# Altium project 100871_project.prjpcb
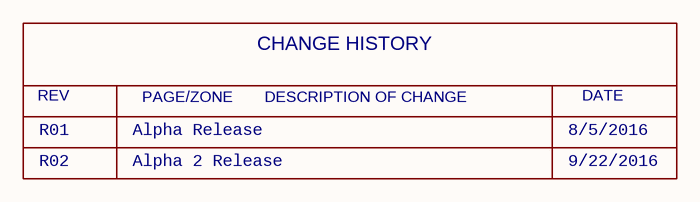
[diagram p0: BlockDiagram.SchDoc]
Board_Name: Trackpad Controller Board; Board_Number: 100871; PCB_Revision: 02; Project_Name: Ventriloquist; Sch_Revision: 02
3 sheets, 95 parts. Net scope: global (net labels, ports and power ports of the same name join across sheets).
Board file: 100871.PcbDoc
Sheets:
  BlockDiagram.SchDoc
  ControlBoard.SchDoc
  RevisionLog.SchDoc

## Sheet BlockDiagram.SchDoc: Block Diagram
size 431 x 279 mm; DrawnBy: D. Bruey; Organization: Synapse Product Development, LLC.; Address1: 1511 6th Ave., Suite 400; Address2: Seattle, Washington 98101; Address3: 206.381.0898; Address4: www.synapse.com; DocumentNumber: 1; SheetNumber: 1; SheetTotal: 3; PageSetup: Record=PageOptions|CenterHorizontal=True|CenterVertical=True|PrintScale=1.06|XCorrection=1.00|YCorrection=1.00|PrintKind=1|BorderSize=5000000|LeftOffset=0|BottomOffset=0|Orientation=2|PaperLength=4318|PaperWidth=2794|Scale=100|PaperSource=7|PrintQuality=200|MediaType=1|DitherType=10|PrintScaleMode=1|PaperKind=11x17|PaperIndex=3

### Notes on the sheet
- REV
- PAGE/ZONE       DESCRIPTION OF CHANGE
- CHANGE HISTORY
- DATE
- R01
- R02
- Alpha Release
- Alpha 2 Release
- 8/5/2016
- 9/22/2016
- Design Notes:
- Layout Notes:
- Project:
- Sheet Title:
- PCBA:
- PROPRIETARY AND CONFIDENTIAL
- Drawn by:
- Schematic Part Number:
- Schematic Revision:
- Date:
- Sheet:
- /

## Sheet ControlBoard.SchDoc: Controls
size 431 x 279 mm; DrawnBy: D. Bruey; Organization: Synapse Product Development, LLC.; Address1: 1511 6th Ave., Suite 400; Address2: Seattle, Washington 98101; Address3: 206.381.0898; Address4: www.synapse.com; DocumentNumber: 2; SheetNumber: 2; SheetTotal: 3; PageSetup: Record=PageOptions|CenterHorizontal=True|CenterVertical=True|PrintScale=1.06|XCorrection=1.00|YCorrection=1.00|PrintKind=1|BorderSize=5000000|LeftOffset=0|BottomOffset=0|Orientation=2|PaperLength=4318|PaperWidth=2794|Scale=100|PaperSource=7|PrintQuality=200|MediaType=1|DitherType=10|PrintScaleMode=1|PaperKind=11x17|PaperIndex=3
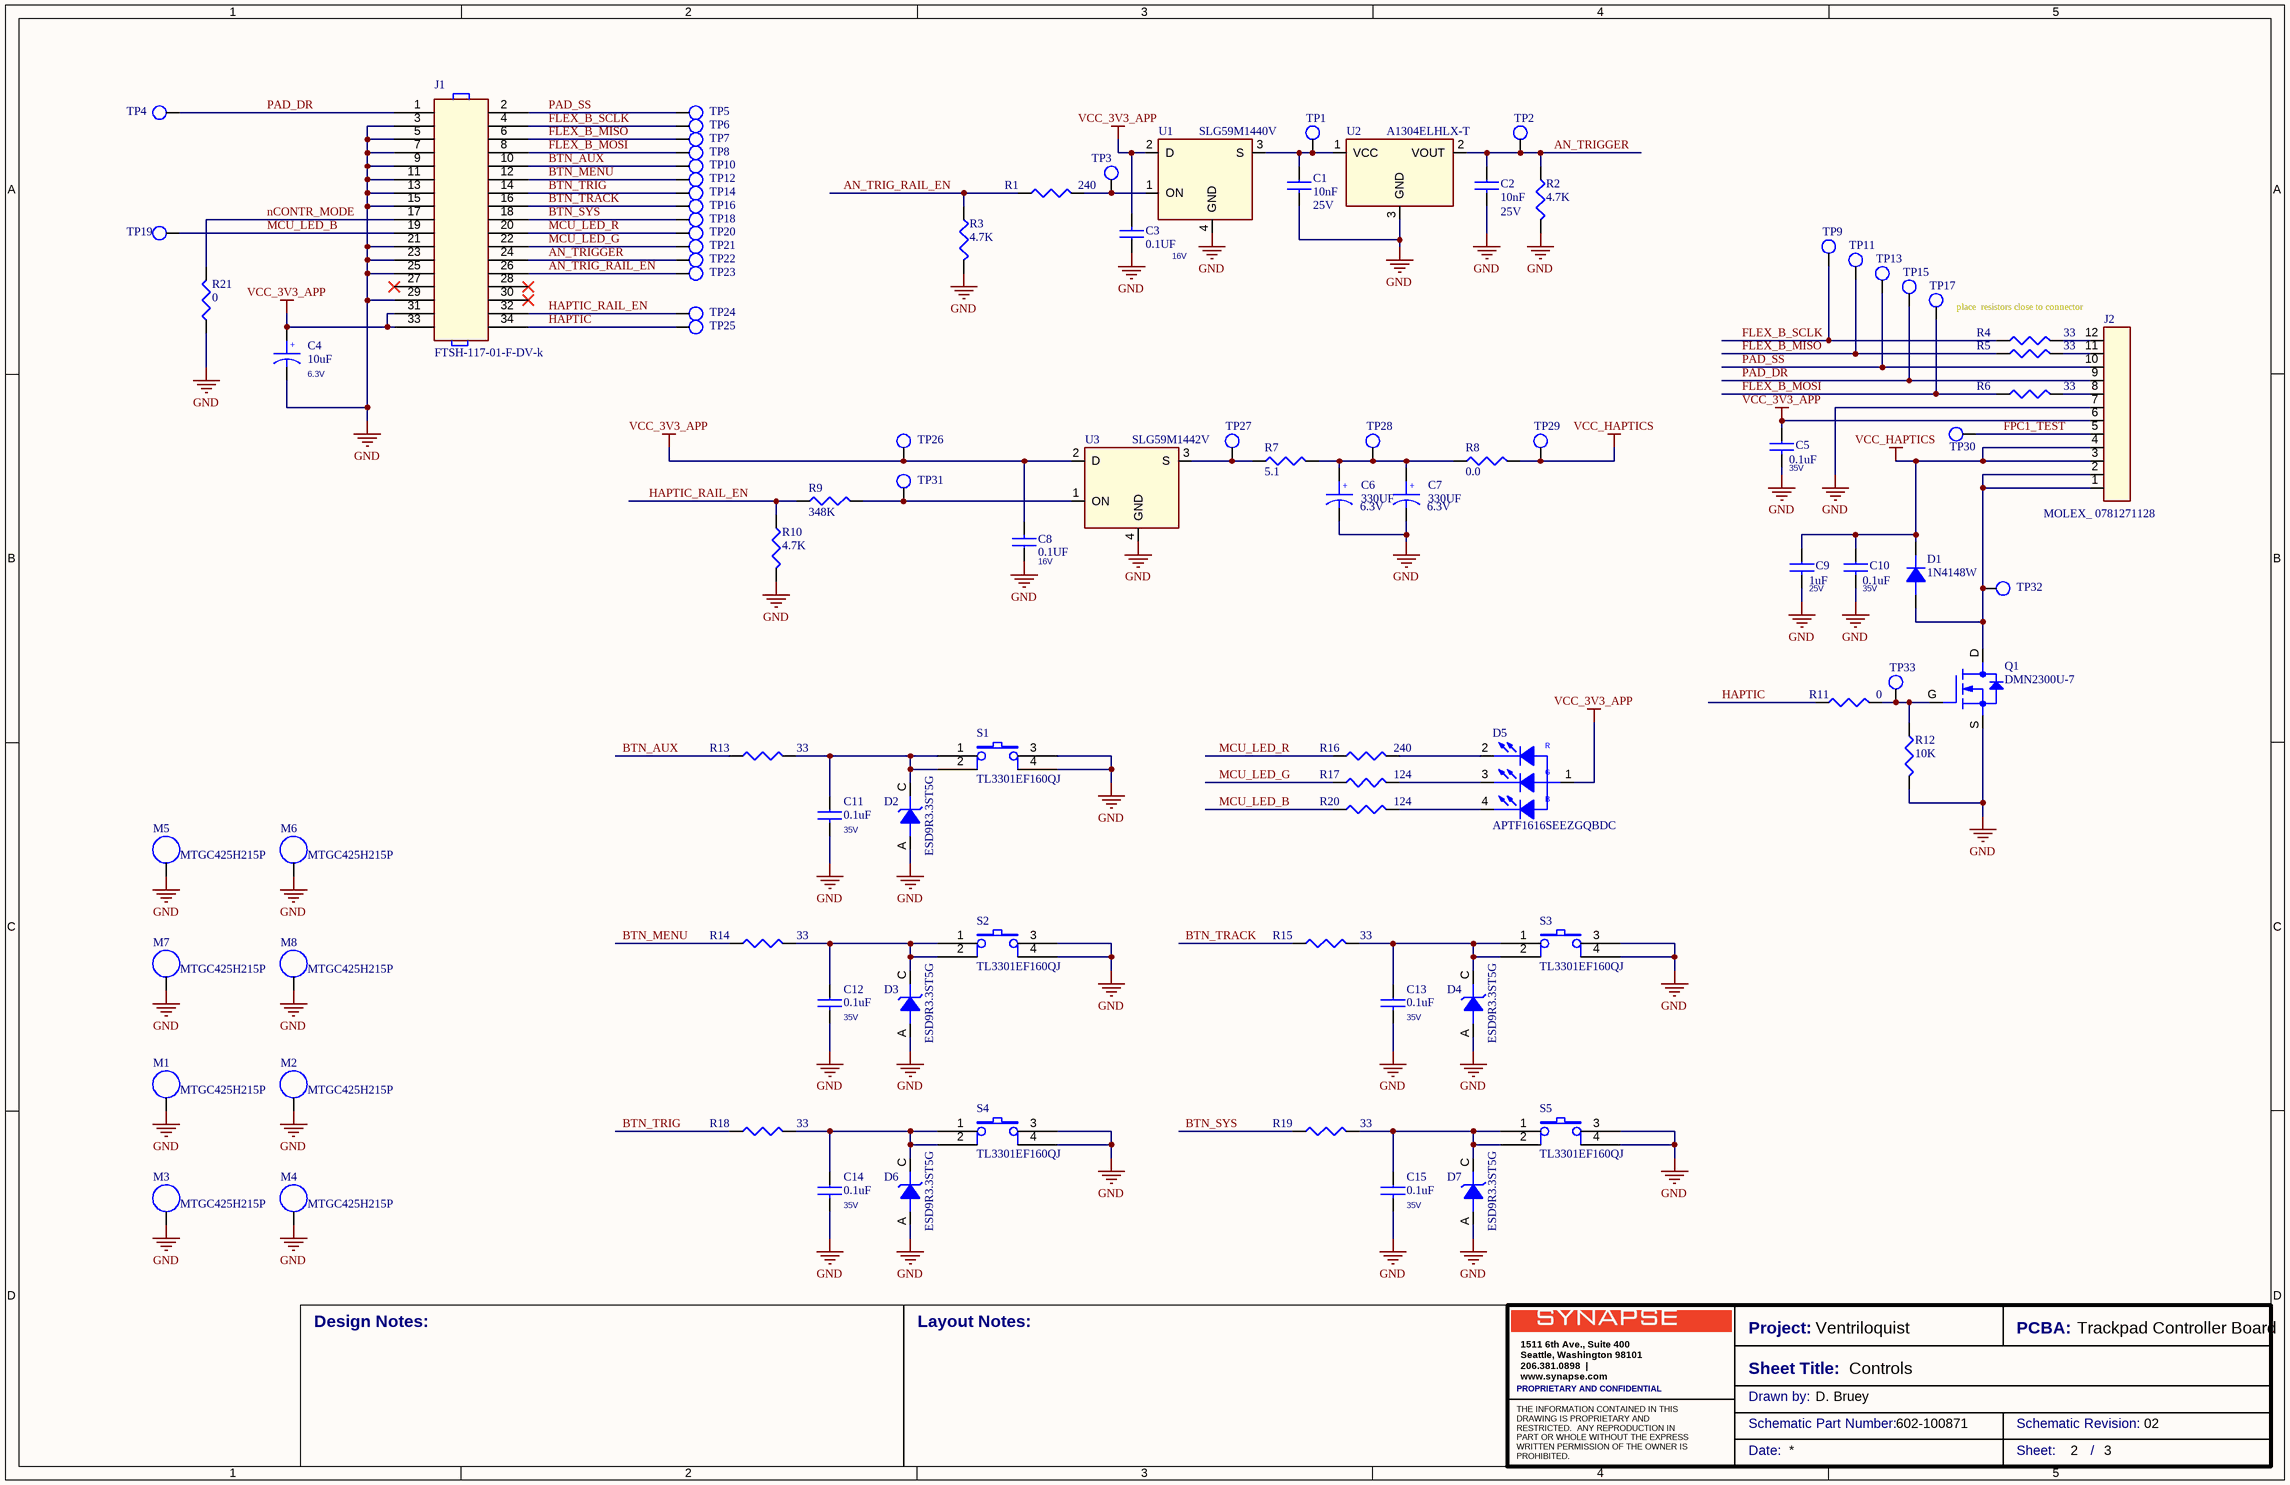
[diagram p1: ControlBoard.SchDoc]

### Parts
C1  10nF  Voltage: 25V  [0402-ipcsm_60]
C2  10nF  Voltage: 25V  [0402-ipcsm_60]
C3  0.1UF  Voltage: 16V  [0603-ipcsm_90]
C4  10uF  Voltage: 6.3V  [c-0603-POL_35H]
C5  0.1uF  Voltage: 35V  [0402-IPCsm_55]
C6  330UF  Voltage: 6.3V  [c-elect_FK-D8]
C7  330UF  Voltage: 6.3V  [c-elect_FK-D8]
C8  0.1UF  Voltage: 16V  [0603-ipcsm_90]
C9  1uF  Voltage: 25V  [0603-IPCsm_90]
C10  0.1uF  Voltage: 35V  [0402-IPCsm_55]
C11  0.1uF  Voltage: 35V  [0402-IPCsm_55]
C12  0.1uF  Voltage: 35V  [0402-IPCsm_55]
C13  0.1uF  Voltage: 35V  [0402-IPCsm_55]
C14  0.1uF  Voltage: 35V  [0402-IPCsm_55]
C15  0.1uF  Voltage: 35V  [0402-IPCsm_55]
D1  1N4148W  [SOD123_135]
D2  ESD9R3.3ST5G  [sod923-40]
D3  ESD9R3.3ST5G  [sod923-40]
D4  ESD9R3.3ST5G  [sod923-40]
D5  APTF1616SEEZGQBDC  [led_RBG_1p6x1p6_sm]
D6  ESD9R3.3ST5G  [sod923-40]
D7  ESD9R3.3ST5G  [sod923-40]
J1  FTSH-117-01-F-DV-k  [FTSH-117-01-XXX-DV-K]
J2  MOLEX_ 0781271128  [con12_molex_0781271128]
M1  MTGC425H215P  [MTGC425H215P]  (no BOM)
M2  MTGC425H215P  [MTGC425H215P]  (no BOM)
M3  MTGC425H215P  [MTGC425H215P]  (no BOM)
M4  MTGC425H215P  [MTGC425H215P]  (no BOM)
M5  MTGC425H215P  [MTGC425H215P]  (no BOM)
M6  MTGC425H215P  [MTGC425H215P]  (no BOM)
M7  MTGC425H215P  [MTGC425H215P]  (no BOM)
M8  MTGC425H215P  [MTGC425H215P]  (no BOM)
Q1  DMN2300U-7  [SOT23-GSD_47H_DMN2075U]
R1  240  [0402-IPCsm_40]
R2  4.7K  [0402-IPCsm_40]
R3  4.7K  [0402-IPCsm_40]
R4  33  [0402-IPCsm_40]
R5  33  [0402-IPCsm_40]
R6  33  [0402-IPCsm_40]
R7  5.1  [r-1206_28H]
R8  0.0  [r-1206_28H]
R9  348K  [0402-IPCsm_40]
R10  4.7K  [0402-IPCsm_40]
R11  0  [0402-IPCsm_40]
R12  10K  [0402-IPCsm_40]
R13  33  [0402-IPCsm_40]
R14  33  [0402-IPCsm_40]
R15  33  [0402-IPCsm_40]
R16  240  [0402-IPCsm_40]
R17  124  [0402-IPCsm_40]
R18  33  [0402-IPCsm_40]
R19  33  [0402-IPCsm_40]
R20  124  [0402-IPCsm_40]
R21  0  [0402-IPCsm_40]
S1  TL3301EF160QJ  [SW_TL3301_J]
S2  TL3301EF160QJ  [SW_TL3301_J]
S3  TL3301EF160QJ  [SW_TL3301_J]
S4  TL3301EF160QJ  [SW_TL3301_J]
S5  TL3301EF160QJ  [SW_TL3301_J]
TP1  tp-1mm  [TP-S100_SMT]  (value not drawn)  (no BOM)
TP2  tp-1mm  [TP-S100_SMT]  (value not drawn)  (no BOM)
TP3  tp-1mm  [TP-S100_SMT]  (value not drawn)  (no BOM)
TP4  tp-1mm  [TP-S100_SMT]  (value not drawn)  (no BOM)
TP5  tp-1mm  [TP-S100_SMT]  (value not drawn)  (no BOM)
TP6  tp-1mm  [TP-S100_SMT]  (value not drawn)  (no BOM)
TP7  tp-1mm  [TP-S100_SMT]  (value not drawn)  (no BOM)
TP8  tp-1mm  [TP-S100_SMT]  (value not drawn)  (no BOM)
TP9  tp-1mm  [TP-S100_SMT]  (value not drawn)  (no BOM)
TP10  tp-1mm  [TP-S100_SMT]  (value not drawn)  (no BOM)
TP11  tp-1mm  [TP-S100_SMT]  (value not drawn)  (no BOM)
TP12  tp-1mm  [TP-S100_SMT]  (value not drawn)  (no BOM)
TP13  tp-1mm  [TP-S100_SMT]  (value not drawn)  (no BOM)
TP14  tp-1mm  [TP-S100_SMT]  (value not drawn)  (no BOM)
TP15  tp-1mm  [TP-S100_SMT]  (value not drawn)  (no BOM)
TP16  tp-1mm  [TP-S100_SMT]  (value not drawn)  (no BOM)
TP17  tp-1mm  [TP-S100_SMT]  (value not drawn)  (no BOM)
TP18  tp-1mm  [TP-S100_SMT]  (value not drawn)  (no BOM)
TP19  tp-1mm  [TP-S100_SMT]  (value not drawn)  (no BOM)
TP20  tp-1mm  [TP-S100_SMT]  (value not drawn)  (no BOM)
TP21  tp-1mm  [TP-S100_SMT]  (value not drawn)  (no BOM)
TP22  tp-1mm  [TP-S100_SMT]  (value not drawn)  (no BOM)
TP23  tp-1mm  [TP-S100_SMT]  (value not drawn)  (no BOM)
TP24  tp-1mm  [TP-S100_SMT]  (value not drawn)  (no BOM)
TP25  tp-1mm  [TP-S100_SMT]  (value not drawn)  (no BOM)
TP26  tp-1mm  [TP-S100_SMT]  (value not drawn)  (no BOM)
TP27  tp-1mm  [TP-S100_SMT]  (value not drawn)  (no BOM)
TP28  tp-1mm  [TP-S100_SMT]  (value not drawn)  (no BOM)
TP29  tp-1mm  [TP-S100_SMT]  (value not drawn)  (no BOM)
TP30  tp-1mm  [TP-S100_SMT]  (value not drawn)  (no BOM)
TP31  tp-1mm  [TP-S100_SMT]  (value not drawn)  (no BOM)
TP32  tp-1mm  [TP-S100_SMT]  (value not drawn)  (no BOM)
TP33  tp-1mm  [TP-S100_SMT]  (value not drawn)  (no BOM)
U1  SLG59M1440V  [STDFN4_SLG59M144x]
U2  A1304ELHLX-T  [sot23-3_A1304_113]
U3  SLG59M1442V  [STDFN4_SLG59M144x]

### Nets
GND: C1.2 C2.2 C3.1 C4.N(NEG) C5.2 C6.N(NEG) C7.N(NEG) C8.1 C9.2 C10.2 C11.2 C12.2 C13.2 C14.2 C15.2 D2.A D3.A D4.A D6.A D7.A J1.3 J1.5 J1.7 J1.9 J1.11 J1.13 J1.15 J1.21 J1.23 J1.25 J1.29 J2.7 M1.1 M2.1 M3.1 M4.1 M5.1 M6.1 M7.1 M8.1 Q1.S R2.2 R3.2 R10.2 R12.2 R21.1 S1.3 S1.4 S2.3 S2.4 S3.3 S3.4 S4.3 S4.4 S5.3 S5.4 U1.4(GND) U2.3(GND) U3.4(GND)
VCC_3V3_APP: C3.2 C4.P(POS) C5.1 C8.2 D5.1(ANODE) J1.31 J1.33 J2.6 TP26.1(TP) U1.2(D) U3.2(D)
VCC_HAPTICS: C9.1 C10.1 D1.C J2.3 J2.4 R8.2 TP29.1(TP)
AN_TRIG_RAIL_EN: J1.26 R1.1 R3.1 TP23.1(TP)
AN_TRIGGER: C2.1 J1.24 R2.1 TP2.1(TP) TP22.1(TP) U2.2(VOUT)
BTN_AUX: J1.10 R13.1 TP10.1(TP)
BTN_MENU: J1.12 R14.1 TP12.1(TP)
BTN_SYS: J1.18 R19.1 TP18.1(TP)
BTN_TRACK: J1.16 R15.1 TP16.1(TP)
BTN_TRIG: J1.14 R18.1 TP14.1(TP)
FLEX_B_MISO: J1.6 R5.1 TP7.1(TP) TP11.1(TP)
FLEX_B_MOSI: J1.8 R6.1 TP8.1(TP) TP17.1(TP)
FLEX_B_SCLK: J1.4 R4.1 TP6.1(TP) TP9.1(TP)
FPC1_TEST: J2.5 TP30.1(TP)
HAPTIC: J1.34 R11.1 TP25.1(TP)
HAPTIC_RAIL_EN: J1.32 R9.1 R10.1 TP24.1(TP)
MCU_LED_B: J1.19 R20.1 TP19.1(TP)
MCU_LED_G: J1.22 R17.1 TP21.1(TP)
MCU_LED_R: J1.20 R16.1 TP20.1(TP)
nCONTR_MODE: J1.17 R21.2
PAD_DR: J1.1 J2.9 TP4.1(TP) TP15.1(TP)
PAD_SS: J1.2 J2.10 TP5.1(TP) TP13.1(TP)
NetC1_1: C1.1 TP1.1(TP) U1.3(S) U2.1(VCC)
NetC6_P: C6.P(POS) C7.P(POS) R7.2 R8.1 TP28.1(TP)
NetC11_1: C11.1 D2.C R13.2 S1.1 S1.2
NetC12_1: C12.1 D3.C R14.2 S2.1 S2.2
NetC13_1: C13.1 D4.C R15.2 S3.1 S3.2
NetC14_1: C14.1 D6.C R18.2 S4.1 S4.2
NetC15_1: C15.1 D7.C R19.2 S5.1 S5.2
NetD1_A: D1.A J2.1 J2.2 Q1.D TP32.1(TP)
NetD5_2: D5.2(R) R16.2
NetD5_3: D5.3(G) R17.2
NetD5_4: D5.4(B) R20.2
NetJ2_8: J2.8 R6.2
NetJ2_11: J2.11 R5.2
NetJ2_12: J2.12 R4.2
NetQ1_G: Q1.G R11.2 R12.1 TP33.1(TP)
NetR1_2: R1.2 TP3.1(TP) U1.1(ON)
NetR7_1: R7.1 TP27.1(TP) U3.3(S)
NetR9_2: R9.2 TP31.1(TP) U3.1(ON)

Not connected (* = marked no-connect by the designer): J1 27* 28* 30*

### Notes on the sheet
- place  resistors close to connector
- Design Notes:
- Layout Notes:
- Project:
- Sheet Title:
- PCBA:
- PROPRIETARY AND CONFIDENTIAL
- Drawn by:
- Schematic Part Number:
- Schematic Revision:
- Date:
- Sheet:
- /
- (in symbol 298D106X06R3M2T) +
- (in symbol EEE-FK0J331XP) +

### Library data of the parts
C1 C2 = C1005X7R1E103K050BB: CAP CER 10000PF 25V 10% X7R 0402; part_type: capacitor; id: 1085; mfg: TDK; dist: DIGIKEY; dist_pn: 445-1260-1-ND; symbol: MASTER_DISCRETE\CAP; TableName: viewAltiumCapacitors; mfg_pn: C1005X7R1E103K050BB; allegro_footprint: 0402-ipcsm_60; source_package: CAP; type: X7R; tolerance: 10%; height: 0.55mm; status: Unknown; SymbolPath: C:\EE-Vault\Libraries\Schematic\MASTER_DISCRETE\CAP; OrCADSymbol: MASTER_DISCRETE\CAP
C3 C8 = C0603C104J4RACTU: CAP CER 0.1UF 16V 5% X7R 0603; part_type: capacitor; id: 1053; mfg: Kemet; dist: Digi-Key; dist_pn: 399-1097-1-ND; symbol: MASTER_DISCRETE\CAP; allegro_footprint: 0603-ipcsm_90,c-0603_36H; source_package: C_0U1_16V_X7R_0603; TableName: viewAltiumCapacitors; mfg_pn: C0603C104J4RACTU; type: X7R; height: 0.87MM; status: Unknown; SymbolPath: C:\EE-Vault\Libraries\Schematic\MASTER_DISCRETE\CAP; OrCADSymbol: MASTER_DISCRETE\CAP; tolerance: 5%
C4 = 298D106X06R3M2T: CAP TANT 10UF 6.3V 20% 0603; part_type: capacitor; id: 800; mfg: Vishay/Sprague; dist: Digikey; dist_pn: 718-1160-1-ND; TableName: viewAltiumCapacitors; symbol: MASTER_DISCRETE\CAP_POL; mfg_pn: 298D106X06R3M2T; type: TANT; tolerance: 20%; height: 0.9mm; status: Unknown; allegro_footprint: c-0603-POL_35H
C5 C10-C15 = GMK105BJ104KV-F: CAP CER 0.1UF 35V 10% X5R 0402; part_type: capacitor; id: 1145; mfg: TAIYO YUDEN; dist: DIGIKEY; dist_pn: 587-1994-1-ND; symbol: MASTER_DISCRETE\CAP; allegro_footprint: 0402-IPCsm_55,c-0402_22H; source_package: C_0.1uF_35V_X5R_0402; TableName: viewAltiumCapacitors; mfg_pn: GMK105BJ104KV-F; type: X5R; tolerance: ±10%; height: 0.55mm; status: Unknown; SymbolPath: C:\EE-Vault\Libraries\Schematic\MASTER_DISCRETE\CAP; OrCADSymbol: MASTER_DISCRETE\CAP
C6 C7 = EEE-FK0J331XP: CAP ALUM 330UF 20% 6.3V SMD; part_type: capacitor; id: 1275; mfg: PANASONIC; dist: DigiKey; dist_pn: PCE3768CT-ND; source_package: C_330U_6V3_ELECT_SMDD; type: ELEC; TableName: viewAltiumCapacitors; symbol: MASTER_DISCRETE\CAP_POL; mfg_pn: EEE-FK0J331XP; tolerance: 20%; height: 8.0mm; status: Good; allegro_footprint: c-elect_FK-D8
C9 = GRM188R61E105KA12D: CAP CER 1UF 25V 10% X5R 0603; part_type: capacitor; id: 563; mfg: Murata; dist: Digikey; dist_pn: 490-3897-1-ND; symbol: MASTER_DISCRETE\CAP; allegro_footprint: 0603-IPCsm_90,c-0603_36H; TableName: viewAltiumCapacitors; mfg_pn: GRM188R61E105KA12D; type: X5R; tolerance: 10%; height: 0.9MM; status: Good; SymbolPath: C:\EE-Vault\Libraries\Schematic\MASTER_DISCRETE\CAP; OrCADSymbol: MASTER_DISCRETE\CAP
D1 = 1N4148W-TP: DIODE SWITCH 100V 0.15A SOD123; id: 1083; mfg: Micro Commercial Co; dist: DIGIKEY; dist_pn: 1N4148WTPMSCT-ND; symbol: MASTER_IC\DIODE; power: 0.4W; TableName: viewAltiumDiscretes; mfg_pn: 1N4148W-TP; part_type: diode; allegro_footprint: SOD123_135; source_package: DIODE; voltage: 100V; height: 1.35MM; current: 0.15A; status: Unknown; SymbolPath: C:\EE-Vault\Libraries\Schematic\MASTER_IC\DIODE; OrCADSymbol: MASTER_IC\DIODE
D2-D4 D6 D7 = ESD9R3.3ST5G: TVS DIODE 3.3VWM 7.8VC SOD923; id: 1102; mfg: On Semiconductor; dist: Digikey; dist_pn: ESD9R3.3ST5GOSCT-ND; voltage: 3.3V; TableName: viewAltiumDiscretes; symbol: MASTER_IC\TVS_UNI; mfg_pn: ESD9R3.3ST5G; part_type: tvs; type: TVS; status: Unknown; height: 0.4mm; allegro_footprint: sod923-40
D5 = APTF1616SEEZGQBDC: LED RGB CLEAR 0606 SMD; id: 1228; mfg: Kingbright; dist: Digikey; dist_pn: 754-1500-2-ND; symbol: MASTER_DISCRETE\RGB_CA_HT-B3053FCH; current: 25mA; TableName: viewAltiumDiscretes; mfg_pn: APTF1616SEEZGQBDC; part_type: LED; allegro_footprint: led_RBG_1p6x1p6_sm; source_package: LED; height: .7mm; status: Unknown
J1 = FTSH-117-01-F-DV-k: 34 Positions Header, Shrouded Connector 0.050" (1.27mm) Surface Mount Gold; id: 1653; mfg: Samtec; dist: Digikey; dist_pn: SAM8912-ND; positions: 34; TableName: viewAltiumConnectors; mfg_pn: FTSH-117-01-F-DV-K; part_type: connector; height: 5.97mm; status: Unknown
J2 = 0781271128: CONN FFC VERT 12POS 0.50MM SMD; part_type: connector; id: 1606; mfg: MOLEX; dist: DIGIKEY; dist_pn: WM10125CT-ND; symbol: \\synapsedev.com\dfs\FS\EE_STUFF\CAD_LIB\MASTER\MASTER_CON\HEADER12; positions: 12; OrCADSymbol: MASTER_CON\HEADER12; TableName: viewAltiumConnectors; mfg_pn: 0781271128; allegro_footprint: con12_molex_0781271128; source_package: MOLEX_ 0781271128; height: 4.1mm; status: Unknown; datasheet: http://www.molex.com/pdm_docs/sd/781271128_sd.pdf; SymbolPath: C:\EE-Vault\Libraries\Schematic\MASTER_CON\HEADER12
M1-M8 = MTGC425H215P: MTG, 4.25mm PAD, 2.15mm Plated Hole; part_type: mounting; id: 1240; dist_pn: None; TableName: viewAltiumMisc; symbol: MASTER_MISC\MTG; mfg_pn: MTGC425H215P; height: 0.05MM; status: Unknown; allegro_footprint: MTGC425H215P
Q1 = DMN2300U-7: MOSFET N-CH 20V 1.24A SOT23; part_type: fet; id: 1226; mfg: Diodes; dist: Digikey; dist_pn: DMN2300U-7DICT-ND; symbol: MASTER_DISCRETE\MOSFET_N_EN_3PIN; allegro_footprint: SOT23-GSD_47H; type: NFET; power: 430mW; TableName: viewAltiumDiscretes; mfg_pn: DMN2300U-7; voltage: 20V; height: 1.2mm; status: Unknown; SymbolPath: C:\EE-Vault\Libraries\Schematic\MASTER_DISCRETE\MOSFET_N_EN_3PIN; OrCADSymbol: MASTER_DISCRETE\MOSFET_N_EN_3PIN
R1 R16 = ERJ-2RKF2400X: RES 240 OHM 1/10W 1% 0402 SMD; part_type: resistor; DIST: Digikey; MFG: Panasonic; DIST_PN: P240LDKR-ND; Power: 0.1W; id: 2285; symbol: MASTER_DISCRETE\RES; TableName: viewAltiumResistors; Allegro_footprint: 0402-IPCsm_40; Tolerance: 1%; Height: 0.4mm; MFG_PN: ERJ-2RKF2400X; status: Good; SymbolPath: C:\EE-Vault\Libraries\Schematic\MASTER_DISCRETE\RES; OrCADSymbol: MASTER_DISCRETE\RES
R2 R3 R10 = ERJ-2RKF4701X: RES 4.70K OHM 1/10W 1% 0402 SMD; part_type: resistor; Allegro_footprint: 0402-IPCsm_40,r-0402_16H; Tolerance: 1.00%; Voltage: 50V; DIST: DIGIKEY; MFG: PANASONIC; DIST_PN: P4.70KLCT-ND; Power: 0.063W; id: 1909; symbol: MASTER_DISCRETE\RES; source_package: R_4K7_1P_0402; TableName: viewAltiumResistors; Height: .4MM; MFG_PN: ERJ-2RKF4701X; status: Unknown; SymbolPath: C:\EE-Vault\Libraries\Schematic\MASTER_DISCRETE\RES; OrCADSymbol: MASTER_DISCRETE\RES
R4-R6 R13-R15 R18 R19 = ERJ-2GEJ330X: RES 33 OHM 1/16W 5% 0402 SMD; part_type: resistor; Allegro_footprint: 0402-IPCsm_40,r-0402_16H; Tolerance: 5.00%; Voltage: 50V; DIST: DIGIKEY; MFG: PANASONIC; DIST_PN: P33JCT-ND; Power: 0.063W; id: 1154; symbol: MASTER_DISCRETE\RES; source_package: R_33_0402_5P; TableName: viewAltiumResistors; Height: .4MM; MFG_PN: ERJ-2GEJ330X; status: Unknown; SymbolPath: C:\EE-Vault\Libraries\Schematic\MASTER_DISCRETE\RES; OrCADSymbol: MASTER_DISCRETE\RES
R7 = RC1206JR-075R1L: RES SMD 5.1 OHM 5% 1/4W 1206; part_type: resistor; Tolerance: 5.00%; DIST: DIGIKEY; MFG: Yageo; DIST_PN: 311-5.1ERCT-ND; Power: 0.25W; id: 2369; symbol: MASTER_DISCRETE\RES; TableName: viewAltiumResistors; Allegro_footprint: r-1206_28H; Height: 0.65mm; MFG_PN: RC1206JR-075R1L; status: Unknown; SymbolPath: C:\EE-Vault\Libraries\Schematic\MASTER_DISCRETE\RES; OrCADSymbol: MASTER_DISCRETE\RES
R8 = ERJ-8GEY0R00V: RES ZERO OHM 1/4W 5% 1206 SMD; part_type: resistor; Tolerance: 5.00%; Voltage: 200V; DIST: DIGIKEY; MFG: Panasonic; DIST_PN: P0.0ECT-ND; Power: 0.25W; id: 1234; symbol: MASTER_DISCRETE\RES; TableName: viewAltiumResistors; Allegro_footprint: r-1206_28H; Height: 0.7MM; MFG_PN: ERJ-8GEY0R00V; status: Unknown; SymbolPath: C:\EE-Vault\Libraries\Schematic\MASTER_DISCRETE\RES; OrCADSymbol: MASTER_DISCRETE\RES
R9 = ERJ-2RKF3483X: RES SMD 348K OHM 1% 1/10W 0402; part_type: resistor; Allegro_footprint: 0402-IPCsm_40,r-0402_16H; Tolerance: 1.00%; DIST: DIGIKEY; MFG: PANASONIC; DIST_PN: P348KLCT-ND; Power: 0.1W; id: 2374; symbol: MASTER_DISCRETE\RES; source_package: R_348K_1P_0402; TableName: viewAltiumResistors; Height: .4MM; MFG_PN: ERJ-2RKF3483X; status: Unknown; SymbolPath: C:\EE-Vault\Libraries\Schematic\MASTER_DISCRETE\RES; OrCADSymbol: MASTER_DISCRETE\RES
R11 R21 = ERJ-2GE0R00X: RES 0.0 OHM 1/10W JUMP 0402 SMD; part_type: resistor; Allegro_footprint: 0402-IPCsm_40,r-0402_16H; Tolerance: 5.00%; DIST: DIGIKEY; MFG: PANASONIC; DIST_PN: P0.0JDKR-ND; Power: 0.063W; id: 1129; symbol: MASTER_DISCRETE\RES; source_package: R_0_5P_0402; TableName: viewAltiumResistors; Height: 0.4MM; MFG_PN: ERJ-2GE0R00X; status: Unknown; SymbolPath: C:\EE-Vault\Libraries\Schematic\MASTER_DISCRETE\RES; OrCADSymbol: MASTER_DISCRETE\RES
R12 = ERJ-2GEJ103X: RES 10K OHM 1/10W 5% 0402 SMD; part_type: resistor; Allegro_footprint: 0402-IPCsm_40,r-0402_16H; DIST: Digikey; MFG: Panasonic; DIST_PN: P10KJCT-ND; id: 2252; symbol: MASTER_DISCRETE\RES; source_package: R_10K_5P_0402; TableName: viewAltiumResistors; Tolerance: 5%; Height: 0.4mm; MFG_PN: ERJ-2GEJ103X; status: Unknown; SymbolPath: C:\EE-Vault\Libraries\Schematic\MASTER_DISCRETE\RES; OrCADSymbol: MASTER_DISCRETE\RES
R17 R20 = RC0402FR-07124RL: RES SMD 124 OHM 1% 1/16W 0402; part_type: resistor; Allegro_footprint: 0402-IPCsm_40,r-0402_16H; Tolerance: 1.00%; DIST: DIGIKEY; MFG: Yageo; DIST_PN: 311-124LRCT-ND; Power: 0.0625W; id: 2370; symbol: MASTER_DISCRETE\RES; TableName: viewAltiumResistors; Height: .4mm; MFG_PN: RC0402FR-07124RL; status: Unknown; SymbolPath: C:\EE-Vault\Libraries\Schematic\MASTER_DISCRETE\RES; OrCADSymbol: MASTER_DISCRETE\RES
S1-S5 = TL3301EF160QJ: SWITCH TACTILE SPST-NO 0.05A 12V; Part Number: TL3301AF260QG; Manufacturer: E-Switch; Dist PN: EG2527CT-ND; id: 1237; dist: Digikey; dist_pn: TL3301EF160QJCT-ND; TableName: viewAltiumMisc; symbol: MASTER_CON\ESWITCH_TL3301AF; Distributor: Digikey; mfg_pn: TL3301EF160QJ; mfg: E-Switch; part_type: switch; status: Unknown; allegro_footprint: SW_TL3301_J
TP1-TP33 = TP0042: TESTPOINT, 1MM SMD, Square pad, Round SM opening; part_type: test_point; mfg_pn: TP0042; mfg: NA; id: 888; symbol: MASTER_MISC\TP_SMT; TableName: viewAltiumMisc; dist: NA; dist_pn: NA; source_package: tp_smt; status: Unknown; allegro_footprint: TP-S100_SMT; SymbolPath: C:\EE-Vault\Libraries\Schematic\MASTER_MISC\TP_SMT; OrCADSymbol: MASTER_MISC\TP_SMT
U1 = SLG59M1440V: Single 40mohm 1A Load Switch w/discharge; part_type: ic; id: 2420; mfg: Silego; voltage: 2.5-5.5V; TableName: viewAltiumIcs; symbol: MASTER_IC\SLG59M144XV; mfg_pn: SLG59M1440V; dist: Silego; dist_pn: SLG59M1440V; source_package: SLG59M1440V; height: .55mm; status: Unknown; datasheet: http://www.mouser.com/ds/2/665/SLG59M1440r111_12112013-463792.pdf; allegro_footprint: STDFN4_SLG59M144x
U2 = A1304ELHLX-T: IC HALL EFFECT SENSOR SOT-23W; id: 2208; mfg: Allegro MicroSystems, LLC; dist: Digikey; dist_pn: 620-1548-2-ND; symbol: MASTER_IC\A1304ELHLX-T; allegro_footprint: _CHECK_A1304ELHLX-T; voltage: 3V ~ 3.6V; tolerance: -40°C ~ 85°C; power: 7.7mA; TableName: viewAltiumIcs; mfg_pn: A1304ELHLX-T; part_type: Hall Effect Sensor; source_package: A1304ELHLX-T; status: Good; SymbolPath: C:\EE-Vault\Libraries\Schematic\MASTER_IC\A1304ELHLX-T; OrCADSymbol: MASTER_IC\A1304ELHLX-T
U3 = SLG59M1442V: Single 40mohm 1A Load Switch; part_type: ic; id: 2418; mfg: Silego; voltage: 2.5-5.5V; TableName: viewAltiumIcs; symbol: MASTER_IC\SLG59M144XV; mfg_pn: SLG59M1442V; dist: Silego; dist_pn: SLG59M1442V; source_package: SLG59M1442V; height: .55mm; status: Unknown; datasheet: http://www.mouser.com/ds/2/665/SLG59M1442r100_08282014-770588.pdf; allegro_footprint: STDFN4_SLG59M144x

## Sheet RevisionLog.SchDoc: Revision Log
size 431 x 279 mm; DrawnBy: D. Bruey; Organization: Synapse Product Development, LLC.; Address1: 1511 6th Ave., Suite 400; Address2: Seattle, Washington 98101; Address3: 206.381.0898; Address4: www.synapse.com; DocumentNumber: 3; SheetNumber: 3; SheetTotal: 3; PageSetup: Record=PageOptions|CenterHorizontal=True|CenterVertical=True|PrintScale=1.06|XCorrection=1.00|YCorrection=1.00|PrintKind=1|BorderSize=5000000|LeftOffset=0|BottomOffset=0|Orientation=2|PaperLength=4318|PaperWidth=2794|Scale=100|PaperSource=7|PrintQuality=200|MediaType=1|DitherType=10|PrintScaleMode=1|PaperKind=11x17|PaperIndex=3
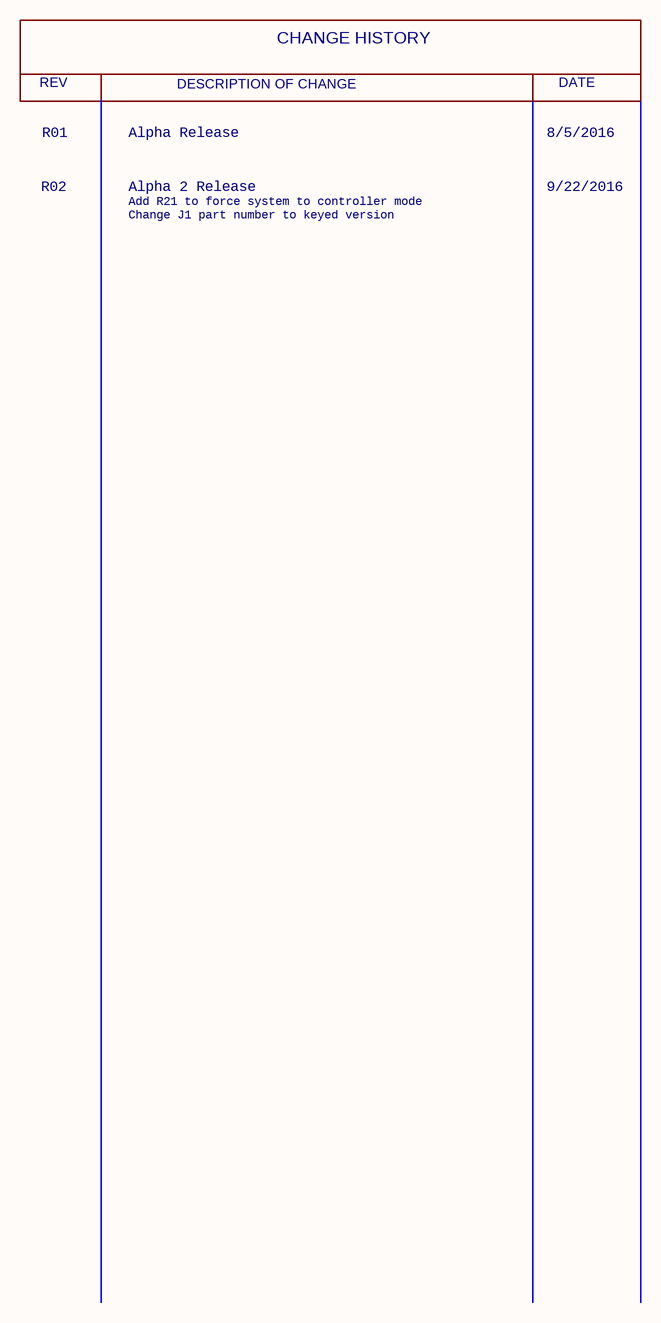
[diagram p2: RevisionLog.SchDoc]

### Notes on the sheet
- REV
- DESCRIPTION OF CHANGE
- CHANGE HISTORY
- DATE
- R01
- Alpha Release
- 8/5/2016
- R02
- Add R21 to force system to controller mode
- Alpha 2 Release
- Change J1 part number to keyed version
- 9/22/2016
- Design Notes:
- Layout Notes:
- Project:
- Sheet Title:
- PCBA:
- PROPRIETARY AND CONFIDENTIAL
- Drawn by:
- Schematic Part Number:
- Schematic Revision:
- Date:
- Sheet:
- /

## Assembly variants
100871: not fitted C2 R2